# EAGLE schematic fit-test (EAGLE 9.1.0)

## Sheet 1 of 5
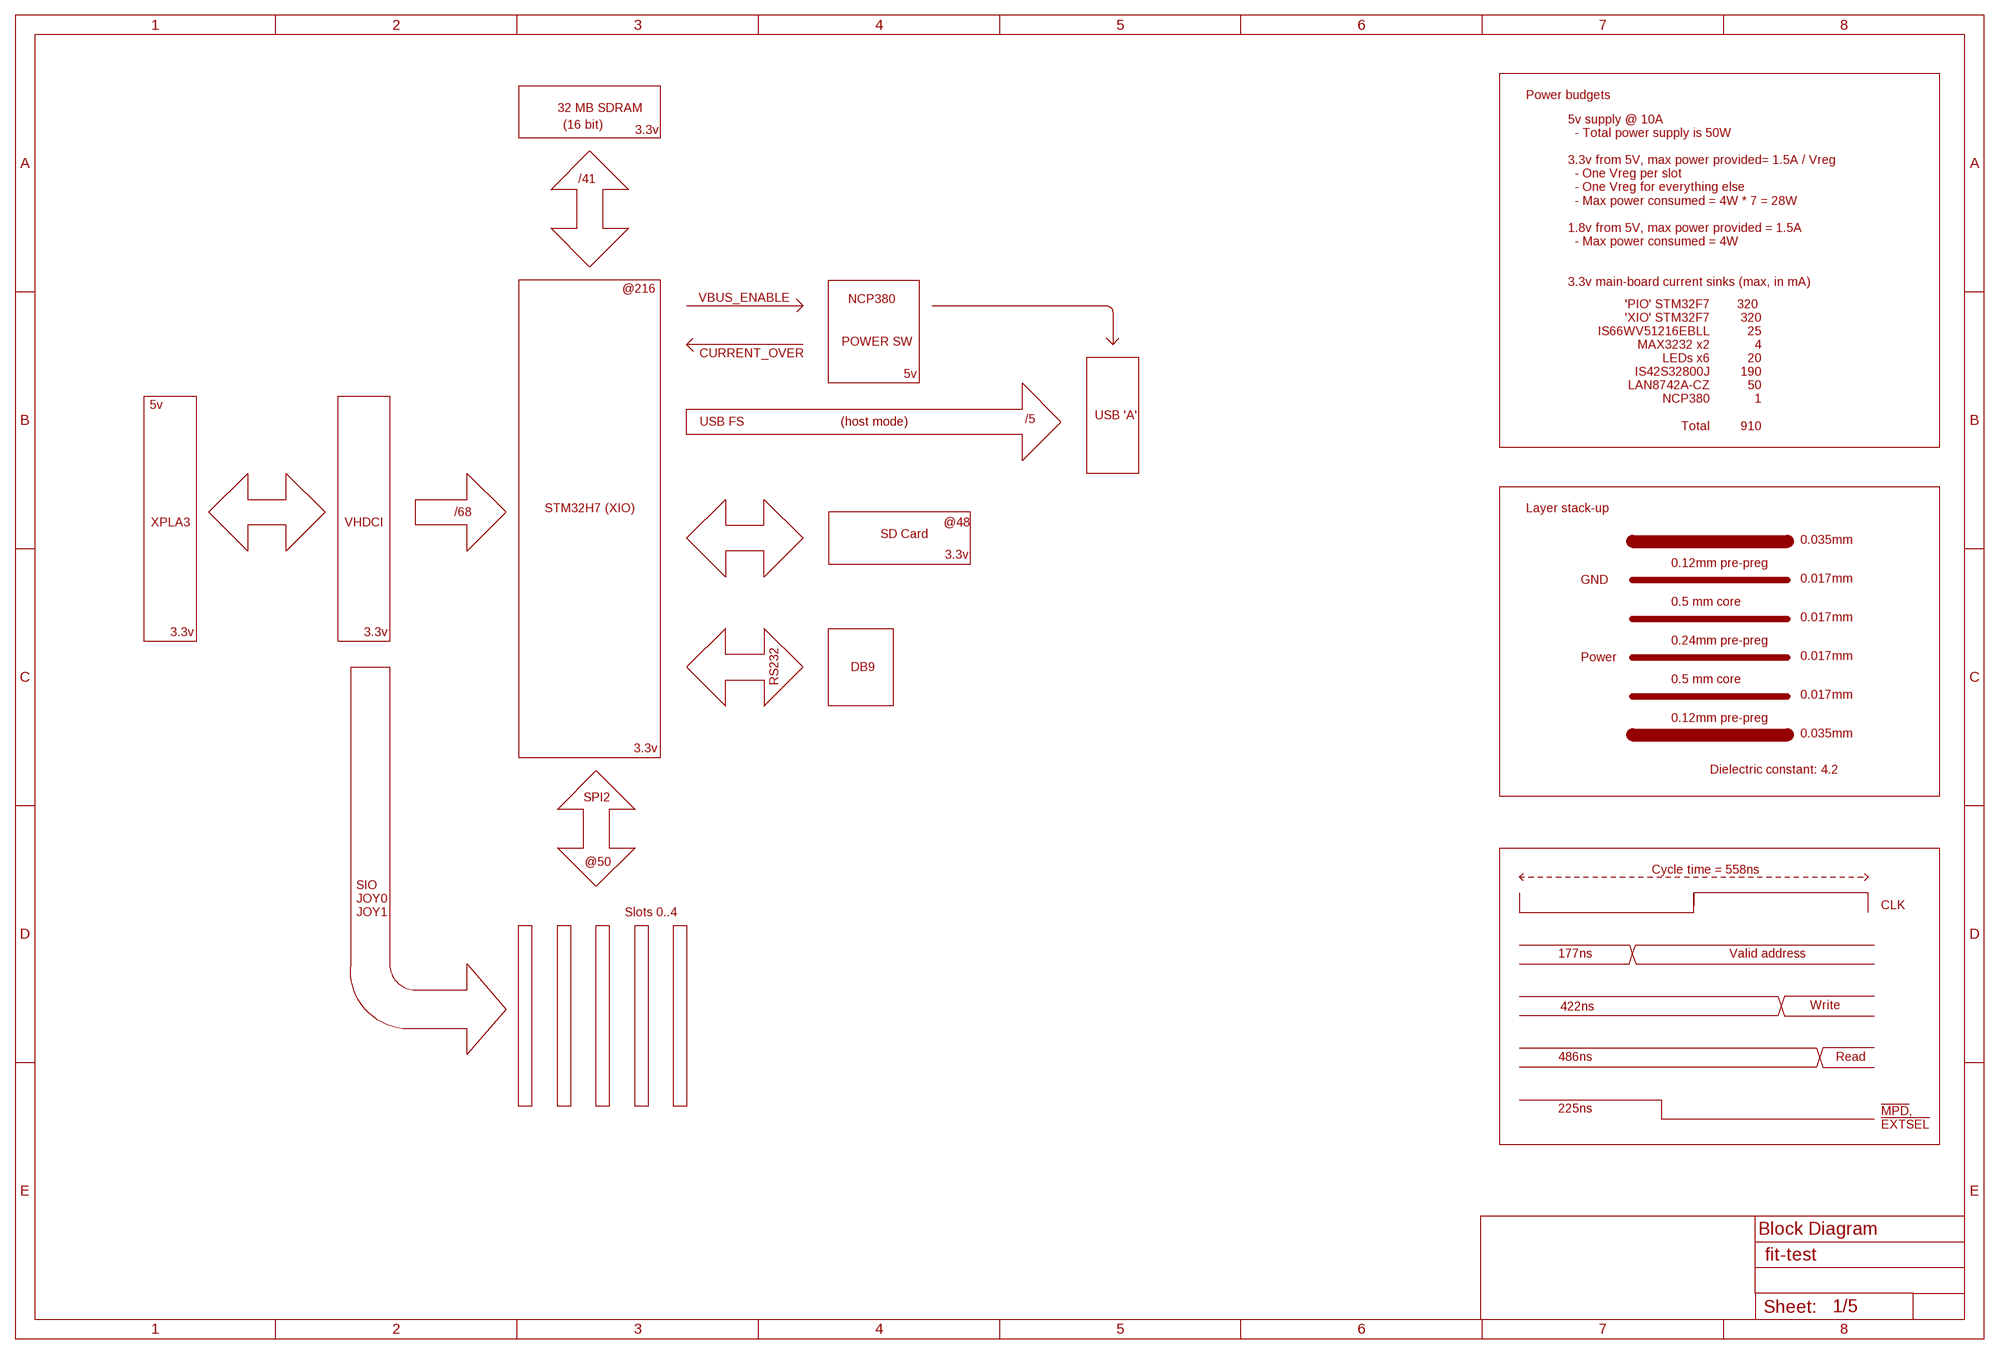
[diagram p0: schematic, sheet 1]

### Notes on the sheet
- Power budgets
- 32 MB SDRAM
- (16 bit)
- 3.3v
- /41
- 5v supply @ 10A
    - Total power supply is 50W
  
  3.3v from 5V, max power provided= 1.5A / Vreg
    - One Vreg per slot
    - One Vreg for everything else
    - Max power consumed = 4W * 7 = 28W 
  
  1.8v from 5V, max power provided = 1.5A
    - Max power consumed = 4W 
  
  
  3.3v main-board current sinks (max, in mA)
- @216 | VBUS_ENABLE
- 'PIO' STM32F7
  'XIO' STM32F7
  IS66WV51216EBLL
  MAX3232 x2
  LEDs x6
  IS42S32800J
  LAN8742A-CZ
  NCP380
  
  Total
- 320 
  320
  25
  4
  20
  190
  50
  1
  
  910
- NCP380
- POWER SW
- CURRENT_OVER
- 5v
- 5v
- USB 'A'
- USB FS | (host mode) | /5
- STM32H7 (XIO) | Layer stack-up
- /68
- XPLA3 | VHDCI | @48
- SD Card
- 0.035mm
- 3.3v
- 0.12mm pre-preg
- GND | 0.017mm
- 0.5 mm core
- 0.017mm
- 3.3v | 3.3v
- 0.24mm pre-preg
- Power | 0.017mm
- DB9
- RS232 | 0.5 mm core
- 0.017mm
- 0.12mm pre-preg
- 0.035mm
- 3.3v
- Dielectric constant: 4.2
- SPI2
- @50
- Cycle time = 558ns
- CLK
- SIO
  JOY0
  JOY1
- Slots 0..4
- 177ns | Valid address
- 422ns | Write
- 486ns | Read
- 225ns
- !MPD!,
  !EXTSEL!
- Block Diagram

## Sheet 2 of 5: XIO Power
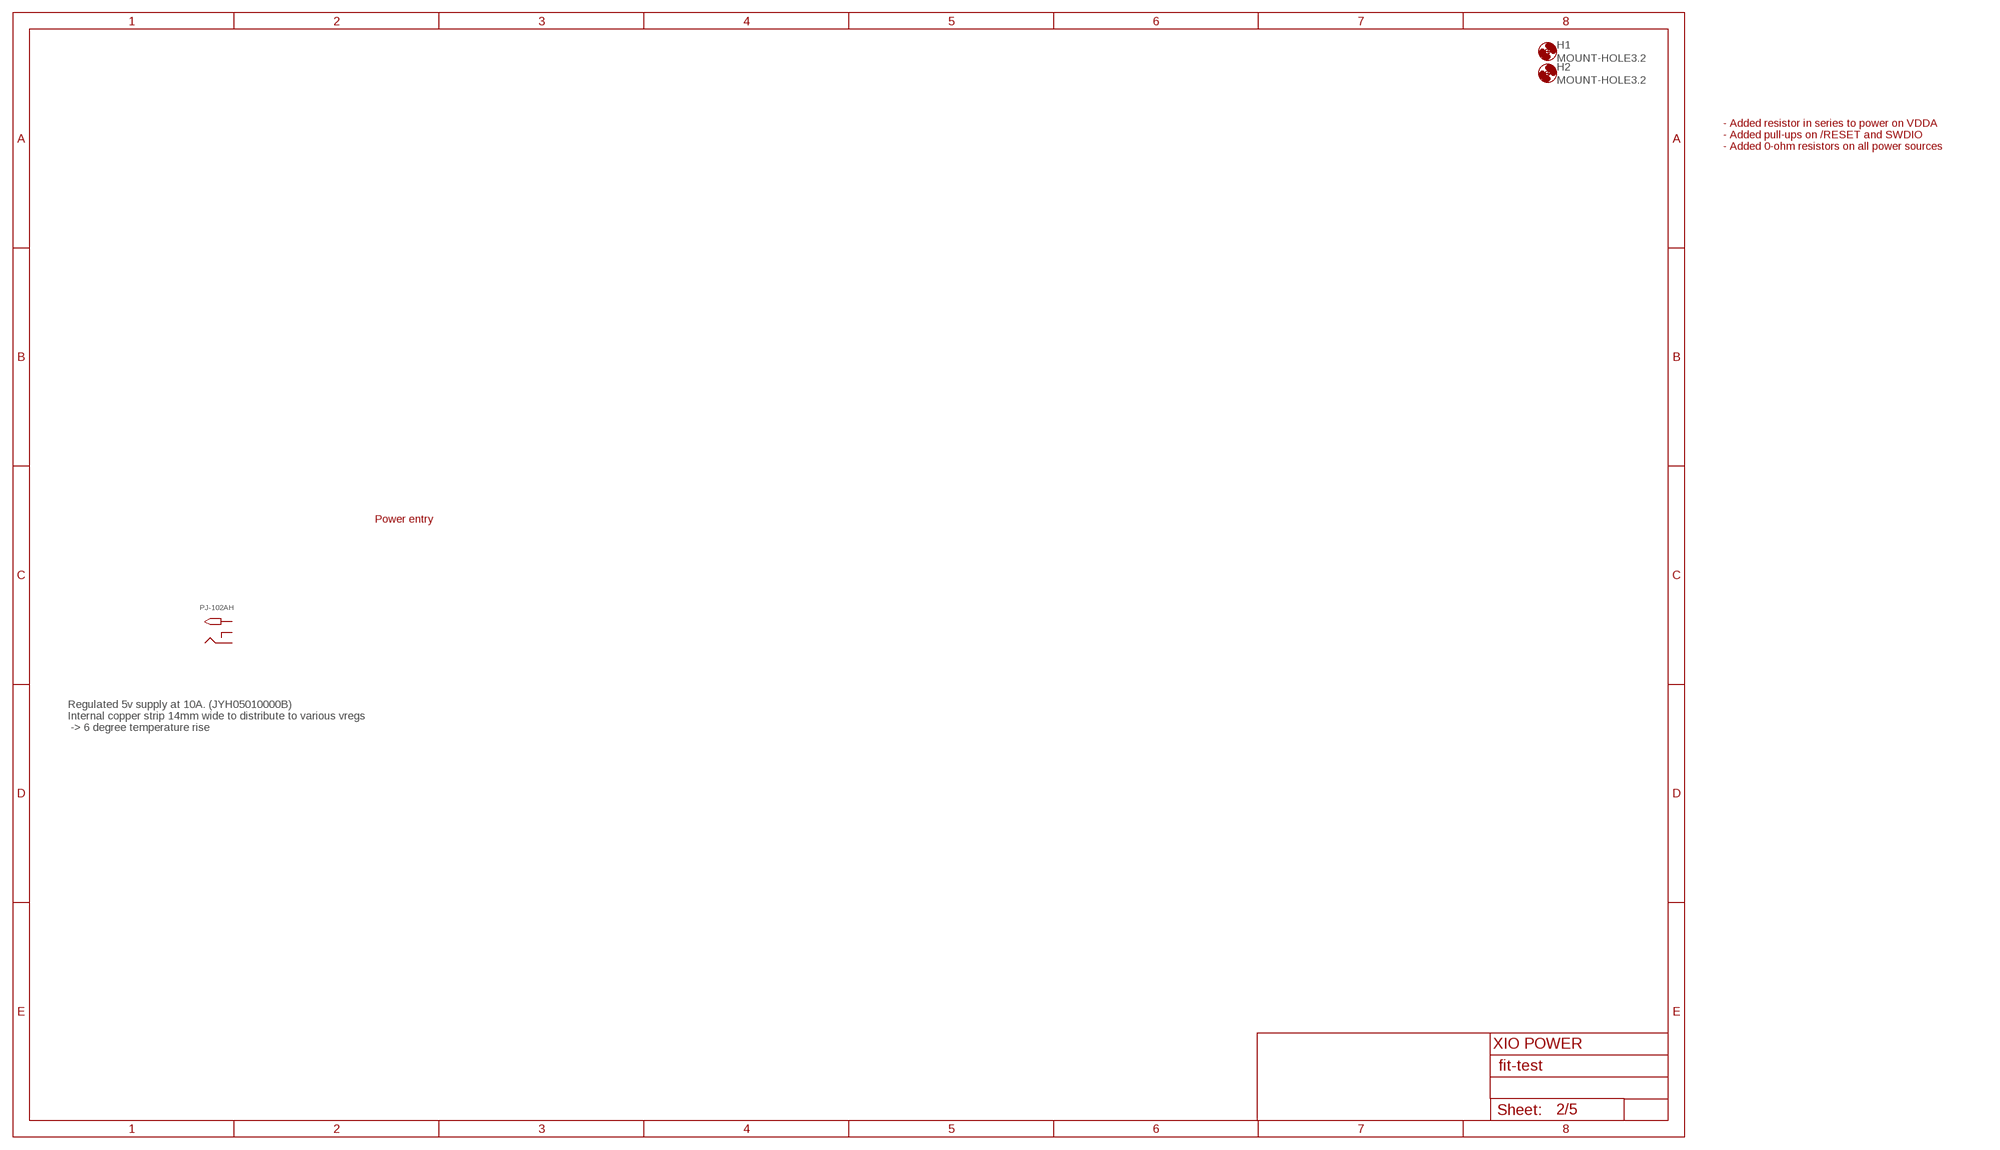
[diagram p1: schematic, sheet 2]

### Parts
H1  MOUNT-HOLE3.2  [3,2]
H2  MOUNT-HOLE3.2  [3,2]
PJ-102AH  PJ-102AH  2.1MMJACKTHM  [PJ-102A]
Unconnected: PJ-102AH.RING PJ-102AH.RING_SW PJ-102AH.TIP

### Notes on the sheet
- - Added resistor in series to power on VDDA
  - Added pull-ups on /RESET and SWDIO
  - Added 0-ohm resistors on all power sources
- Power entry
- Regulated 5v supply at 10A. (JYH05010000B)
  Internal copper strip 14mm wide to distribute to various vregs
   -> 6 degree temperature rise
- XIO POWER

## Sheet 3 of 5: XIO VHDCI interface
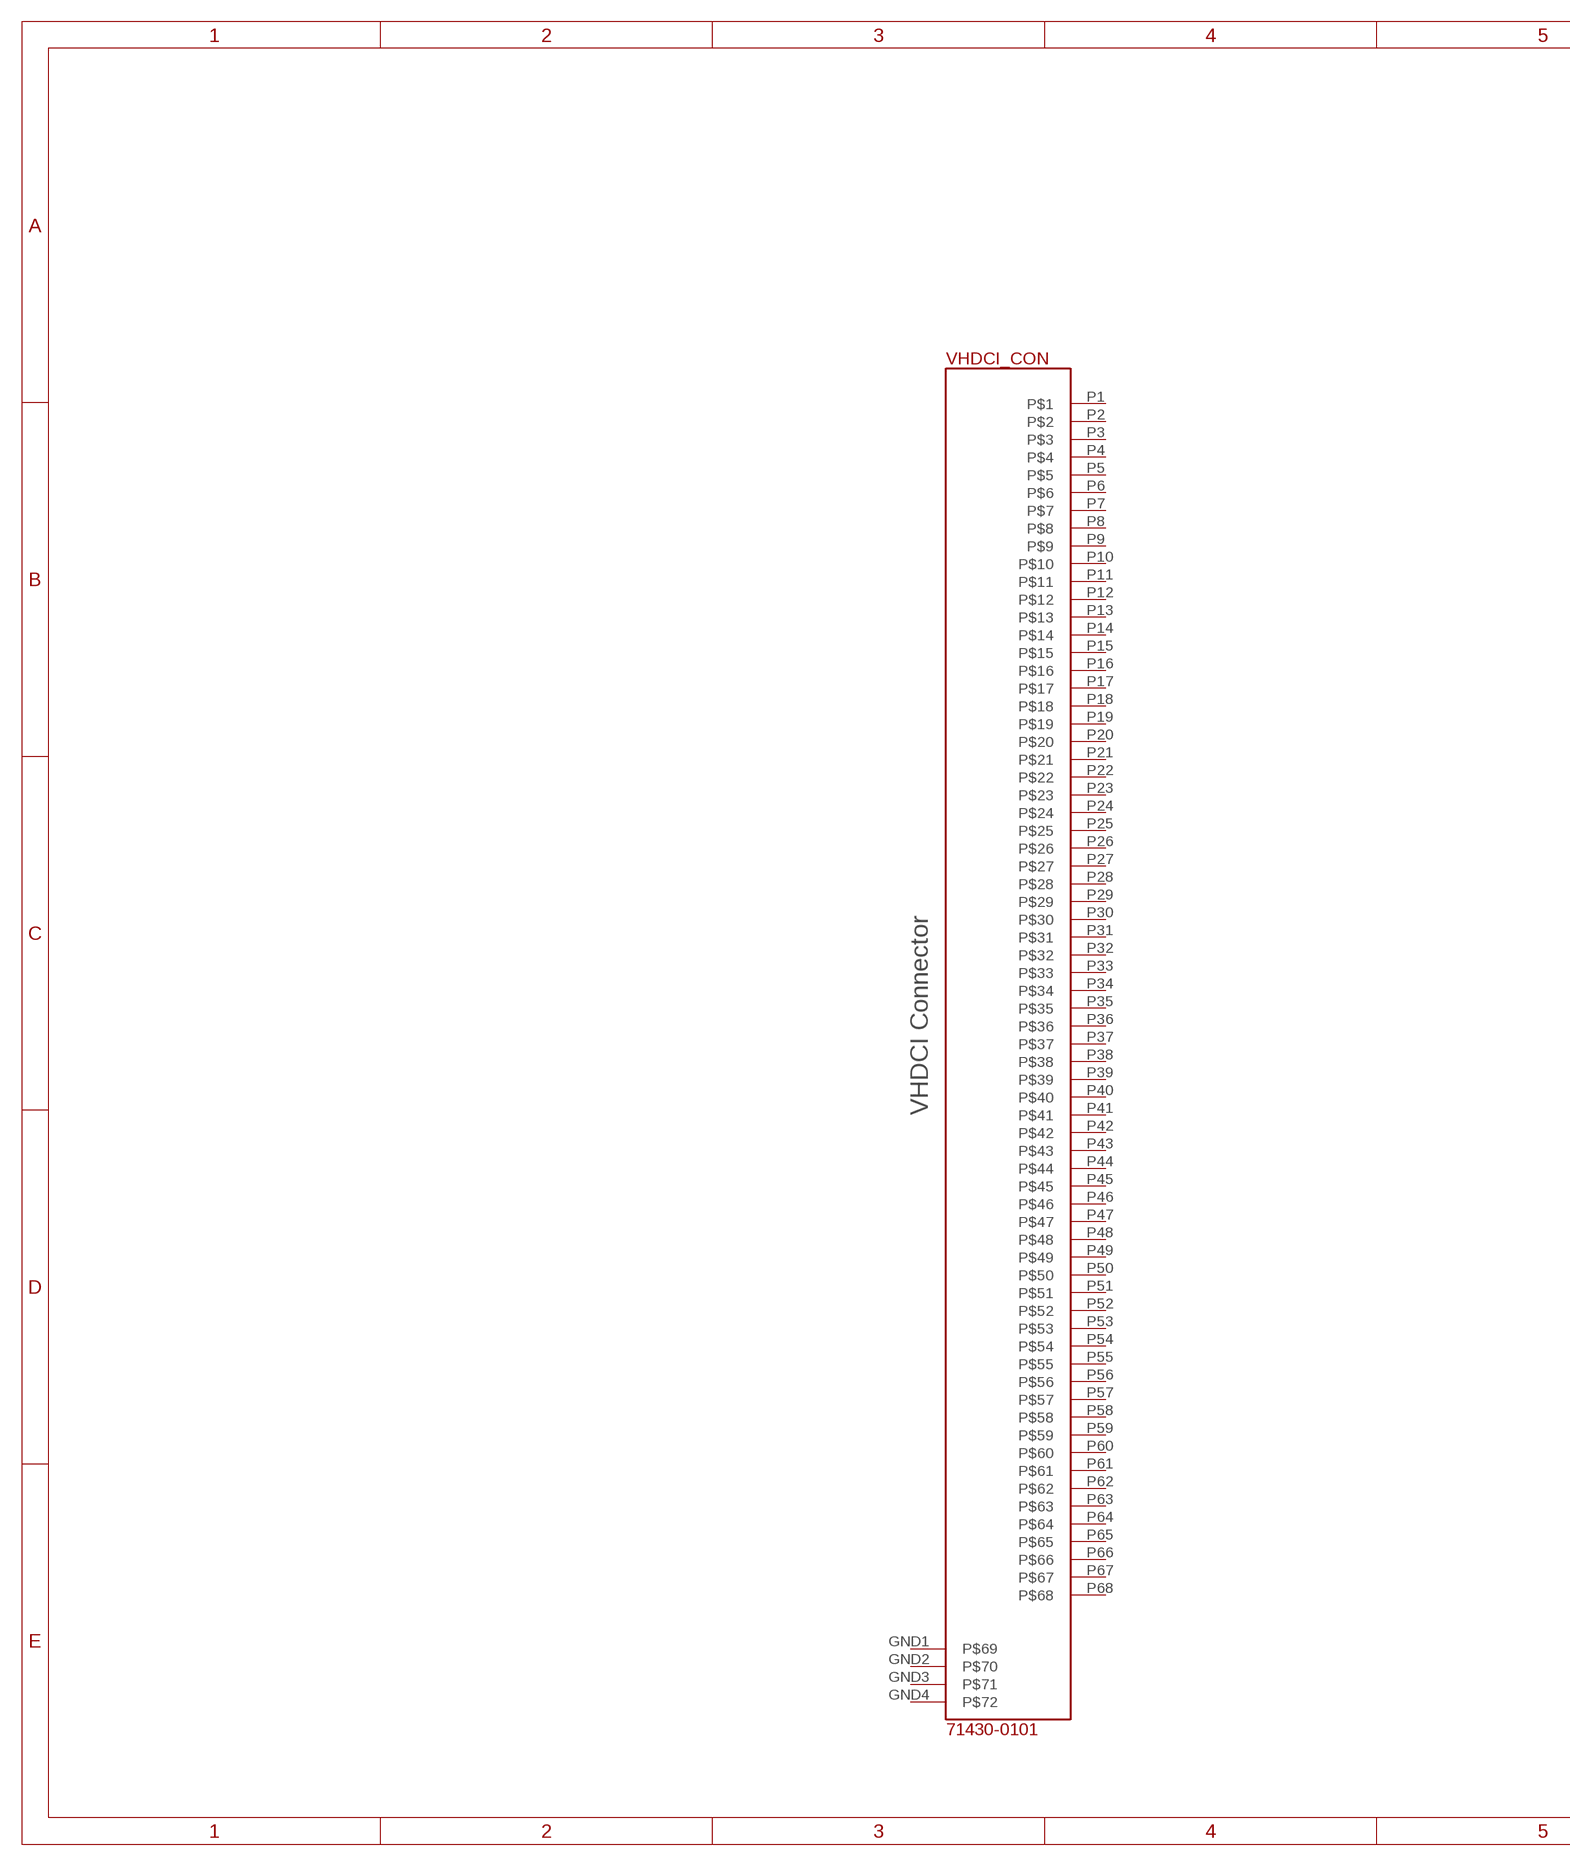
[diagram p2: schematic, sheet 3, part 1 of 2]
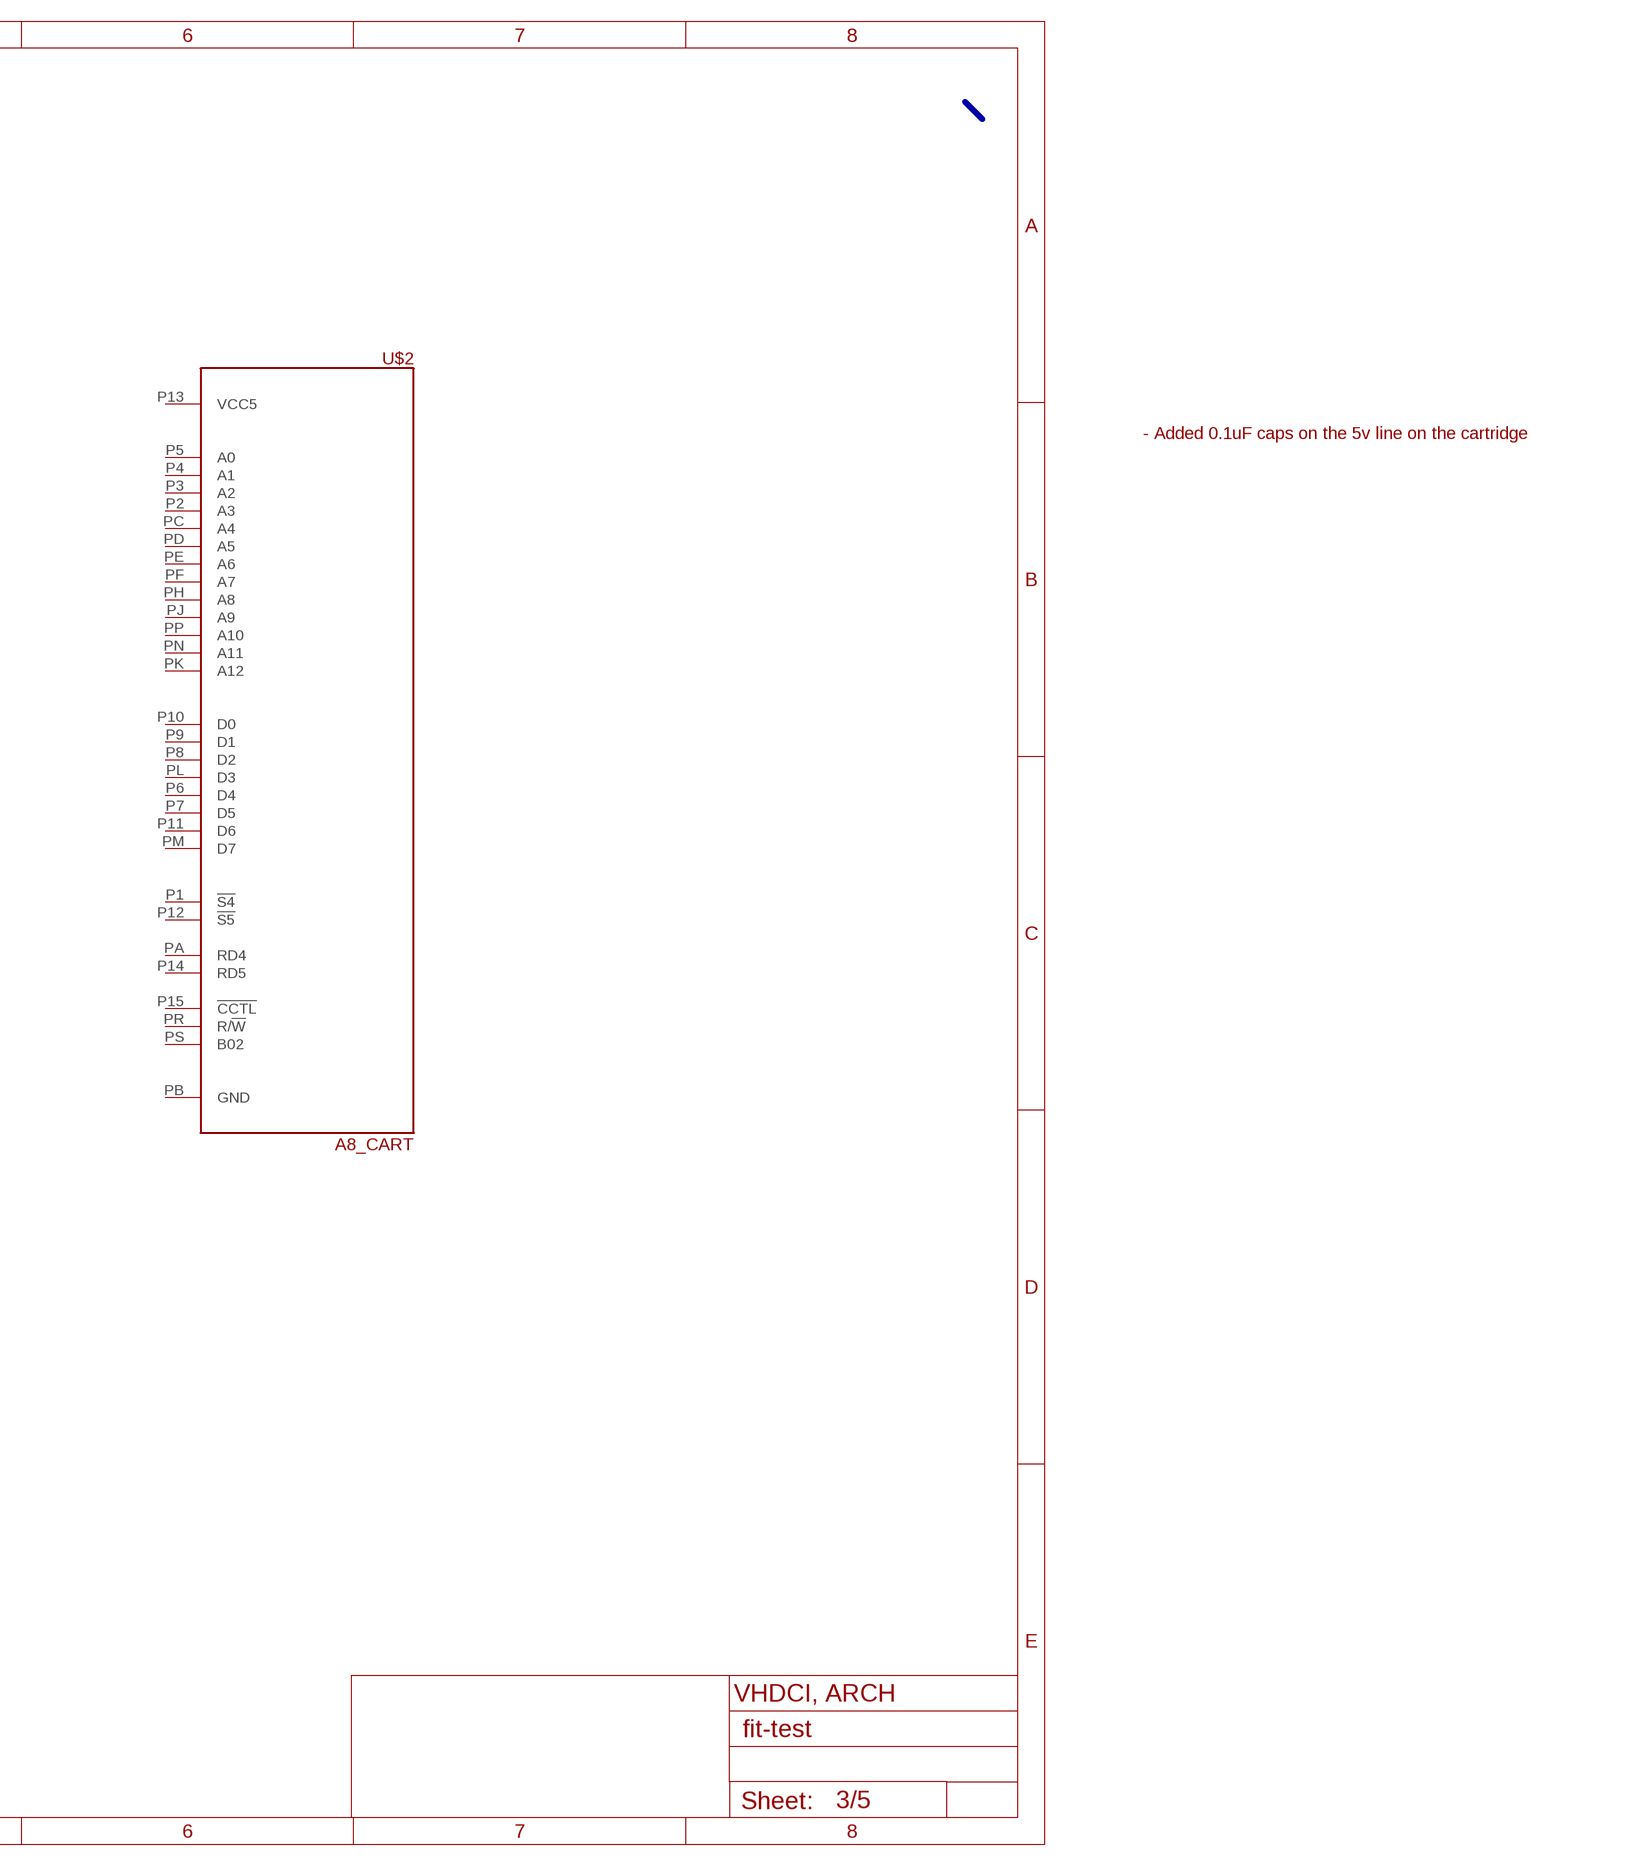
[diagram p3: schematic, sheet 3, part 2 of 2]

### Parts
U$2  A8_CART  [A8_CART]
VHDCI_CON  71430-0101  [71430-0101]
Unconnected: U$2.P1(!S4!) U$2.P2(A3) U$2.P3(A2) U$2.P4(A1) U$2.P5(A0) U$2.P6(D4) U$2.P7(D5) U$2.P8(D2) U$2.P9(D1) U$2.P10(D0) U$2.P11(D6) U$2.P12(!S5!) U$2.P13(VCC5) U$2.P14(RD5) U$2.P15(!CCTL!) U$2.PA(RD4) U$2.PB(GND) U$2.PC(A4) U$2.PD(A5) U$2.PE(A6) U$2.PF(A7) U$2.PH(A8) U$2.PJ(A9) U$2.PK(A12) U$2.PL(D3) U$2.PM(D7) U$2.PN(A11) U$2.PP(A10) U$2.PR(R/!W!) U$2.PS(B02) VHDCI_CON.GND1 VHDCI_CON.GND2 VHDCI_CON.GND3 VHDCI_CON.GND4 VHDCI_CON.P1 VHDCI_CON.P2 VHDCI_CON.P3 VHDCI_CON.P4 VHDCI_CON.P5 VHDCI_CON.P6 VHDCI_CON.P7 VHDCI_CON.P8 VHDCI_CON.P9 VHDCI_CON.P10 VHDCI_CON.P11 VHDCI_CON.P12 VHDCI_CON.P13 VHDCI_CON.P14 VHDCI_CON.P15 VHDCI_CON.P16 VHDCI_CON.P17 VHDCI_CON.P18 VHDCI_CON.P19 VHDCI_CON.P20 VHDCI_CON.P21 VHDCI_CON.P22 VHDCI_CON.P23 VHDCI_CON.P24 VHDCI_CON.P25 VHDCI_CON.P26 VHDCI_CON.P27 VHDCI_CON.P28 VHDCI_CON.P29 VHDCI_CON.P30 VHDCI_CON.P31 VHDCI_CON.P32 VHDCI_CON.P33 VHDCI_CON.P34 VHDCI_CON.P35 VHDCI_CON.P36 VHDCI_CON.P37 VHDCI_CON.P38 VHDCI_CON.P39 VHDCI_CON.P40 VHDCI_CON.P41 VHDCI_CON.P42 VHDCI_CON.P43 VHDCI_CON.P44 VHDCI_CON.P45 VHDCI_CON.P46 VHDCI_CON.P47 VHDCI_CON.P48 VHDCI_CON.P49 VHDCI_CON.P50 VHDCI_CON.P51 VHDCI_CON.P52 VHDCI_CON.P53 VHDCI_CON.P54 VHDCI_CON.P55 VHDCI_CON.P56 VHDCI_CON.P57 VHDCI_CON.P58 VHDCI_CON.P59 VHDCI_CON.P60 VHDCI_CON.P61 VHDCI_CON.P62 VHDCI_CON.P63 VHDCI_CON.P64 VHDCI_CON.P65 VHDCI_CON.P66 VHDCI_CON.P67 VHDCI_CON.P68

### Buses
VHDCI:VHDCI_A[0..15],VHDCI_AUDIO_L,VHDCI_AUDIO_R,VHDCI_AUDIO_SIO,VHDCI_CCTL,VHDCI_CLK,VHDCI_COMMAND,VHDCI_D[0..7],VHDCI_D1XX,VHDCI_DATA_OUT,!VHDCI_EXSEL!,VHDCI_GND,VHDCI_HALT,!VHDCI_IRQ!,VHDCI_J1_[1..5],VHDCI_J1_A1,VHDCI_J1_A2,VHDCI_J2_[1..5],VHDCI_J2_A1,VHDCI_J2_A2,!VHDCI_MPD!,VHDCI_MTR_CTRL,VHDCI_RD4,VHDCI_RD5,VHDCI_REF,VHDCI_RSRVD[0..6],VHDCI_RST,VHDCI_RW,VHDCI_S4,VHDCI_S5,VHDCI_SIO_CLK_IN,VHDCI_SIO_DATA_IN

### Notes on the sheet
- - Added 0.1uF caps on the 5v line on the cartridge
- VHDCI Connector
- VHDCI, ARCH

## Sheet 4 of 5: XIO Serial I/O
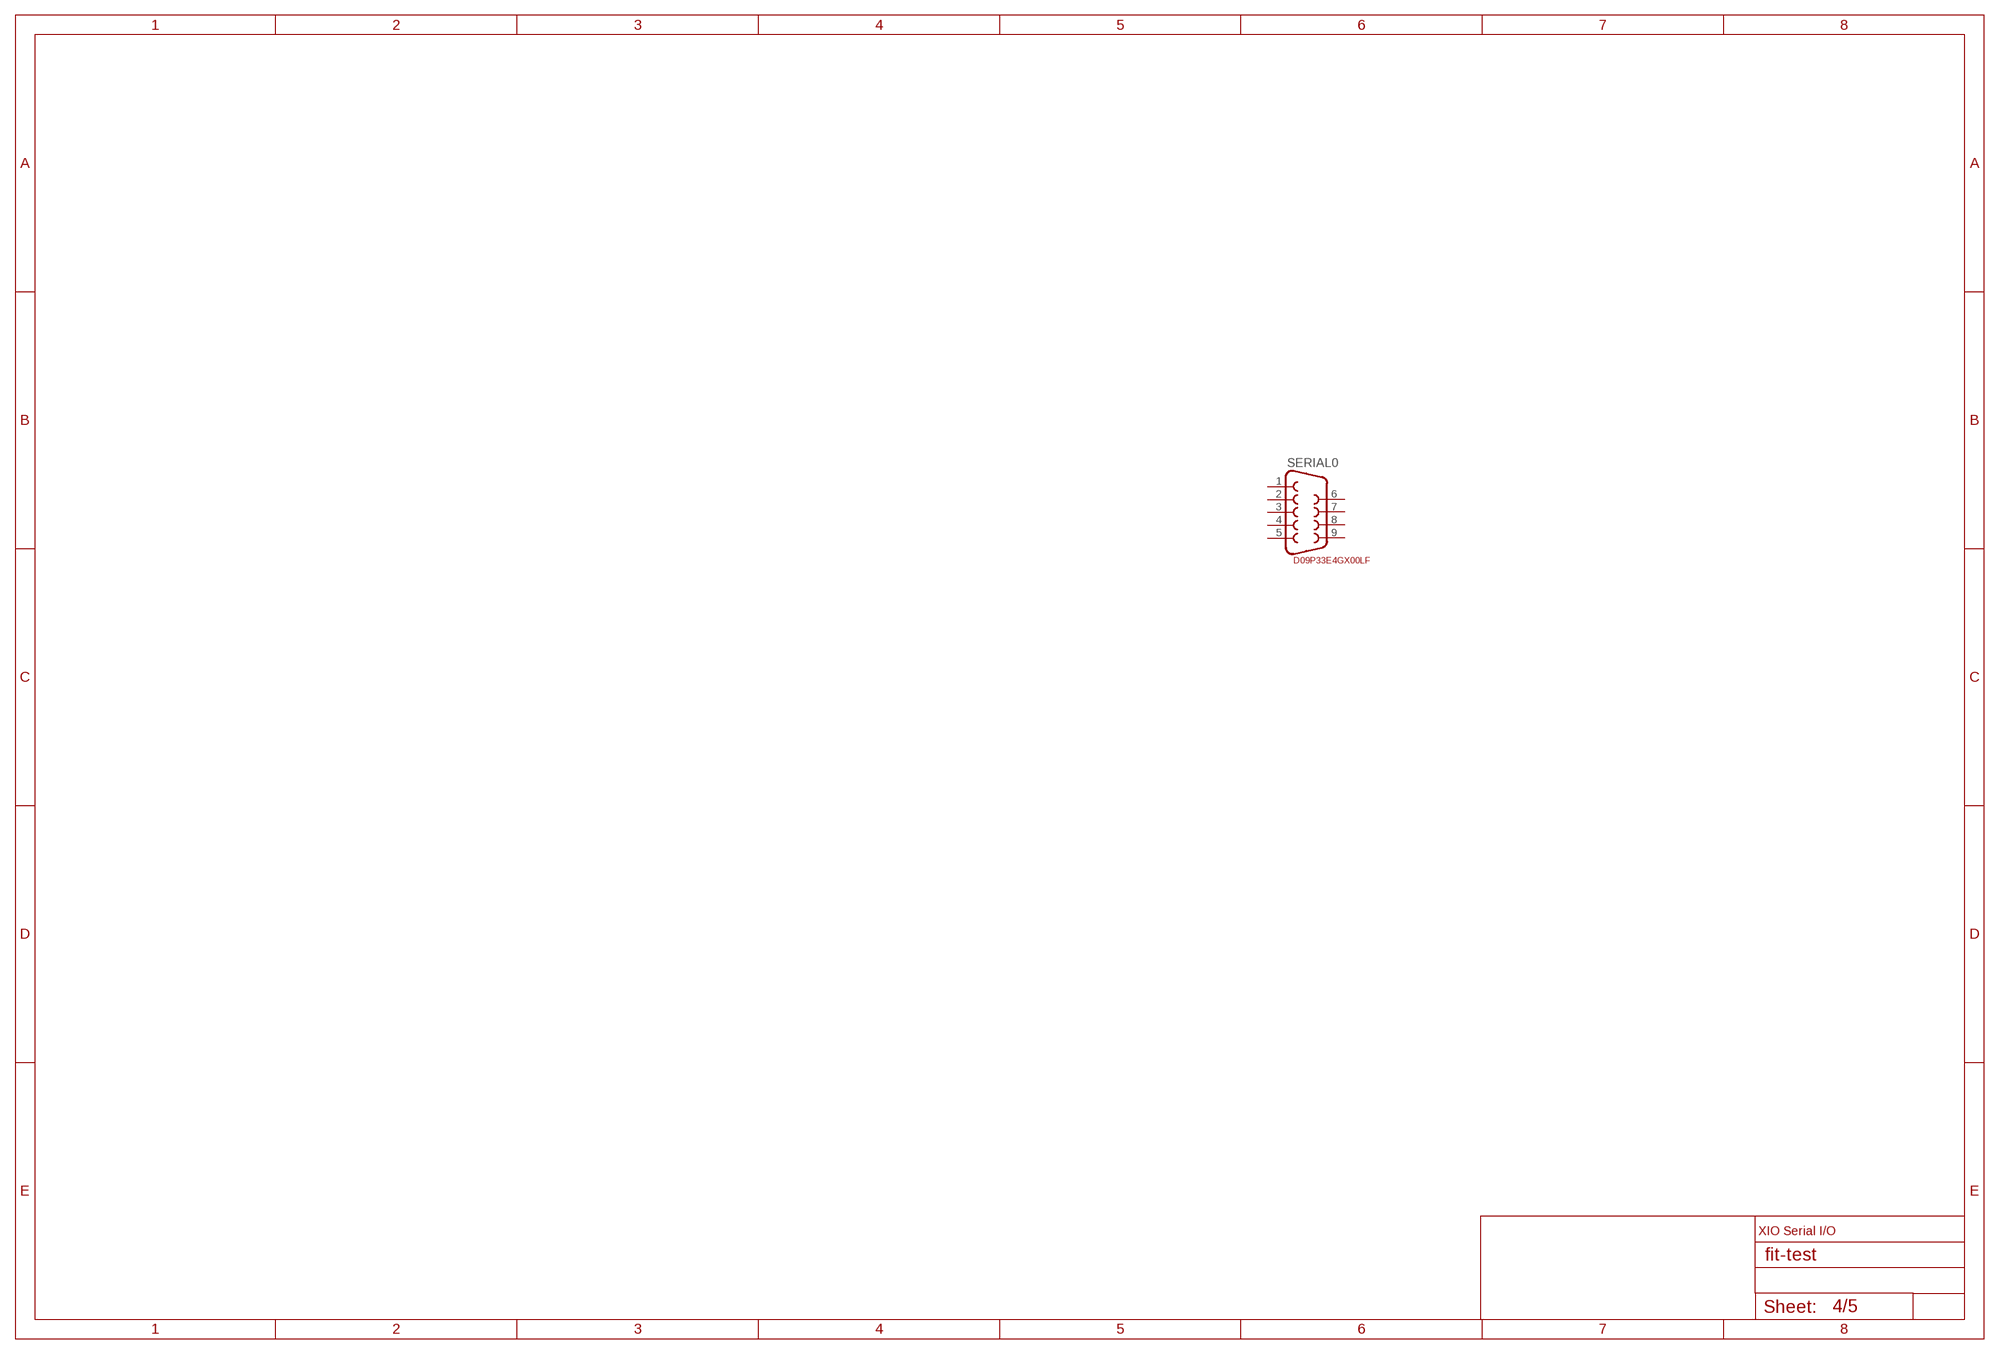
[diagram p4: schematic, sheet 4]

### Parts
SERIAL0  DB9  [DB9]
Unconnected: SERIAL0.1 SERIAL0.2 SERIAL0.3 SERIAL0.4 SERIAL0.5 SERIAL0.6 SERIAL0.7 SERIAL0.8 SERIAL0.9

### Notes on the sheet
- D09P33E4GX00LF
- XIO Serial I/O

## Sheet 5 of 5: XIO USB Host only
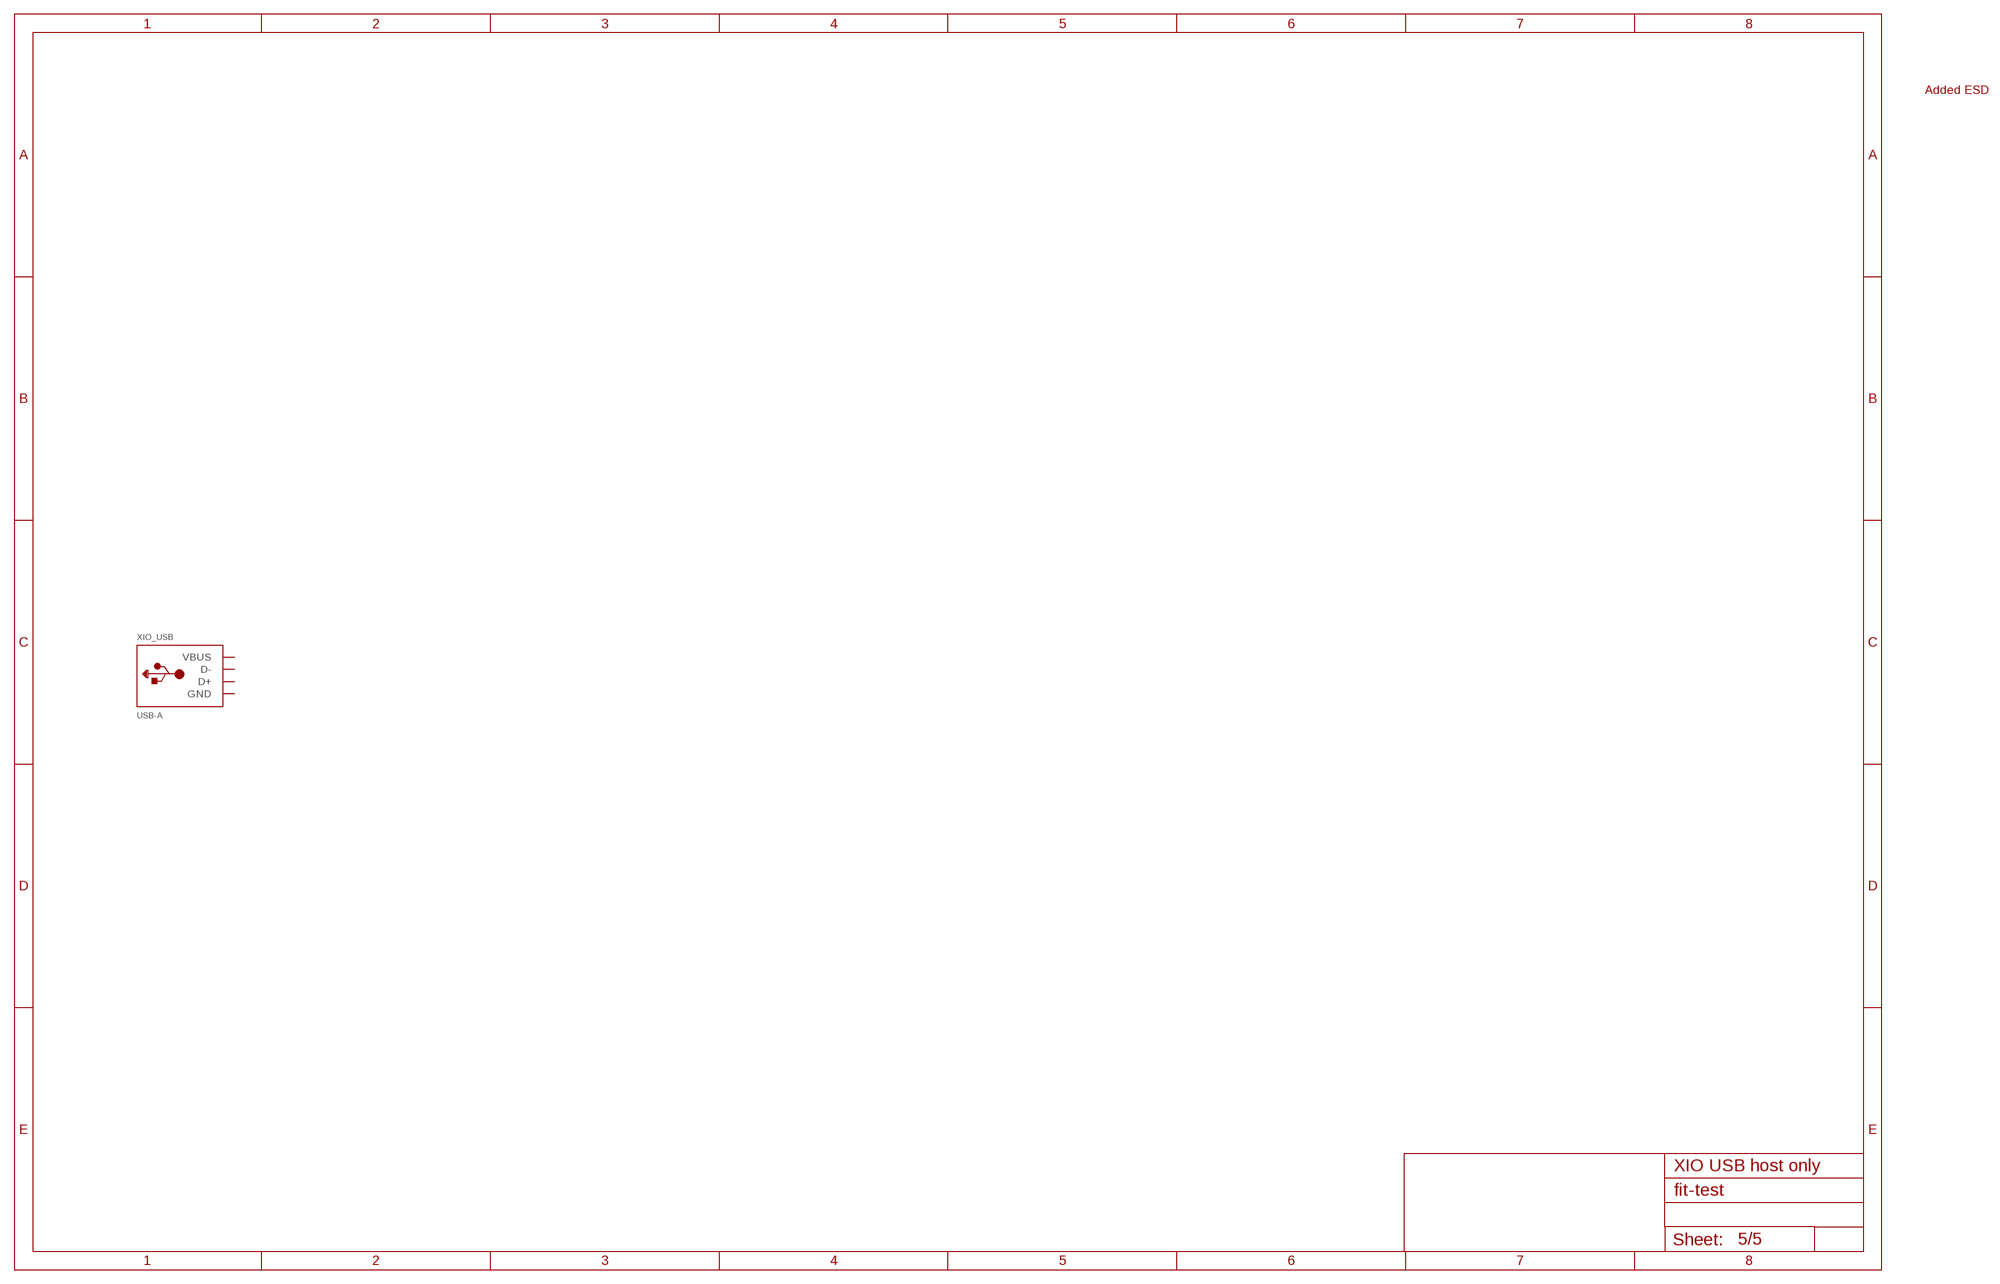
[diagram p5: schematic, sheet 5]

### Parts
XIO_USB  USB-A  [MOLEX_480371000]
Unconnected: XIO_USB.2(D-) XIO_USB.3(D+)

### Notes on the sheet
- Added ESD
- XIO USB host only

## Power pins joined to a net without a drawn wire
GND: XIO_USB.4(GND)
VBUS: XIO_USB.1(VBUS)

## Library data of the parts
H1 H2 = holes:MOUNT-HOLE: MOUNTING HOLE with drill center marker
PJ-102AH = adafruit:2.1MMJACK: 2.1mm x 5.5mm THM DC jack with internal switch. Digikey part #PJ-102A, 4UCON part #05537 2.1mm x 5.5mm SMT DC jack with internal switch. Digikey part #PJ-002A-SMT, 4UCON part #03267 By microbuilder.eu & adafruit.com
SERIAL0 = SparkFun:DB9: DB9 Connector Standard DB9 (D-Sub 9) serial connector. Can be used for CAN bus as well as RS485 and RS232. Footprint production proven. Spark Fun Electronics SKU : PRT-00429
U$2 = sjg-con:A8_CART
VHDCI_CON = sjg-vhdci:71430-0101
XIO_USB = adafruit:USB-A: USB type A 'plug' Used for things that can directly connect to a USB port, say USB key

## Net classes
1 Power: width 0.305 mm, drill 0.203 mm
2 Slot-power: width 0.508 mm
3 tx100: width 0.254 mm, clearance 0.457 mm
4 usb90: width 0.508 mm, clearance 0.61 mm